# Altium schematic sheet schematic.SchDoc
size A4
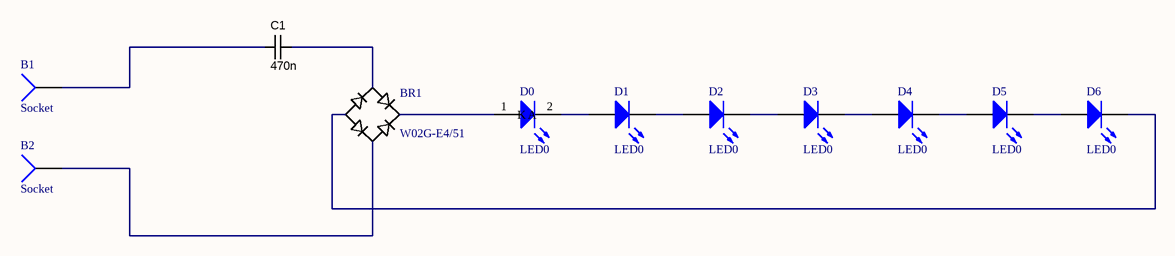
[diagram p0: schematic.SchDoc]

## Parts
B1  Socket  [PIN1]
B2  Socket  [PIN1]
BR1  W02G-E4/51  [DIOB_W02G-E4/51]
C1  470n  [CAPR7.62-6.8x2.5]
D0  LED0  [LED-0]
D1  LED0  [LED-0]
D2  LED0  [LED-0]
D3  LED0  [LED-0]
D4  LED0  [LED-0]
D5  LED0  [LED-0]
D6  LED0  [LED-0]

## Nets
NetB1_1: B1.1 C1.1
NetB2_1: B2.1 BR1.3(AC2)
NetBR1_1: BR1.1(AC1) C1.2
NetBR1_2: BR1.2(+) D0.1(A)
NetBR1_4: BR1.4(-) D6.2(K)
NetD0_2: D0.2(K) D1.1(A)
NetD1_2: D1.2(K) D2.1(A)
NetD2_2: D2.2(K) D3.1(A)
NetD3_2: D3.2(K) D4.1(A)
NetD4_2: D4.2(K) D5.1(A)
NetD5_2: D5.2(K) D6.1(A)

## Library data of the parts
BR1 = W02G-E4/51: Diode Rectifier Bridge Single 200V 1.5A 4-Pin Case WOG Bulk; MF: Vishay; Availability: Good; MP: W02G-E4/51; Package: 4-4 Vishay; Price: 0.35 USD; Value: *
C1 = CAPMF_470n_100V_MK: Capacitor THD MK Film 470nF 10% 100V; Manufacturer 1: Panasonic - ECG; Manufacturer Part Number 1: ECQ-E1474KF; Material: Metallized Polyester; SCDType: undef; Package / Case: 12.5L x 4.5T x 9.0H x 10.0mm Pitch; Tolerance: ±10%; Ratings: 100V; Supplier 1: Digi-Key; Supplier Part Number 1: EF1474-ND; Value: 470n
D0-D6 = LED0: Typical INFRARED GaAs LED; Published: 8-Jun-2000; LatestRevisionDate: 08-Jul-2005; LatestRevisionNote: Mech Layer 1 removed.; PackageReference: LED-0; Publisher: Altium Limited; PackageDescription: LED; 2 Leads
B1 B2 = Socket: LatestRevisionDate: 17-Jul-2002; LatestRevisionNote: Re-released for DXP Platform.; Publisher: Altium Limited